# Altium project mezanine.PrjPCB
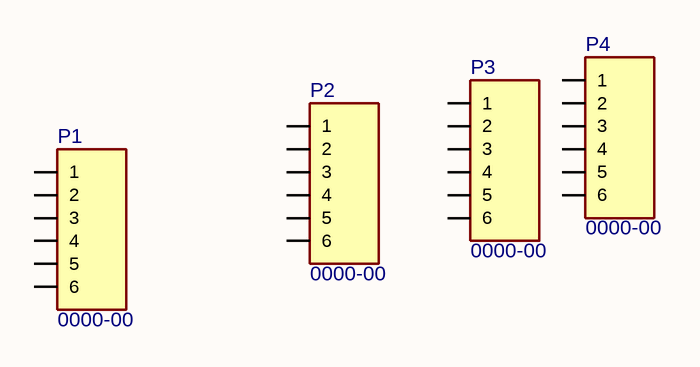
[diagram p0: mezanine-toplevel.SchDoc]
1 sheet, 4 parts. Net scope: global (net labels, ports and power ports of the same name join across sheets).
Board file: mezanine.PcbDoc

## Sheet mezanine-toplevel.SchDoc: Yard-Ice-Top
size 365 x 274 mm; Revision: 1.0; SheetNumber: 1; SheetTotal: 5

### Parts
P1  0000-00  [TSW-106-07-G-S]
P2  0000-00  [TSW-106-07-G-S]
P3  0000-00  [TSW-106-07-G-S]
P4  0000-00  [TSW-106-07-G-S]

### Nets

Not connected (* = marked no-connect by the designer): P1 1 2 3 4 5 6; P2 1 2 3 4 5 6; P3 1 2 3 4 5 6; P4 1 2 3 4 5 6

### Notes on the sheet
- TITLE
- CHK
- DWN
- APV
- DWG
- REV
- File:
- Sheet
- of

### Library data of the parts
P1-P4 = Header 6: Header, 6-Pin; MF: Samtec; Package: *; PN: 0000-00; ExtraInfo: *; Value: *